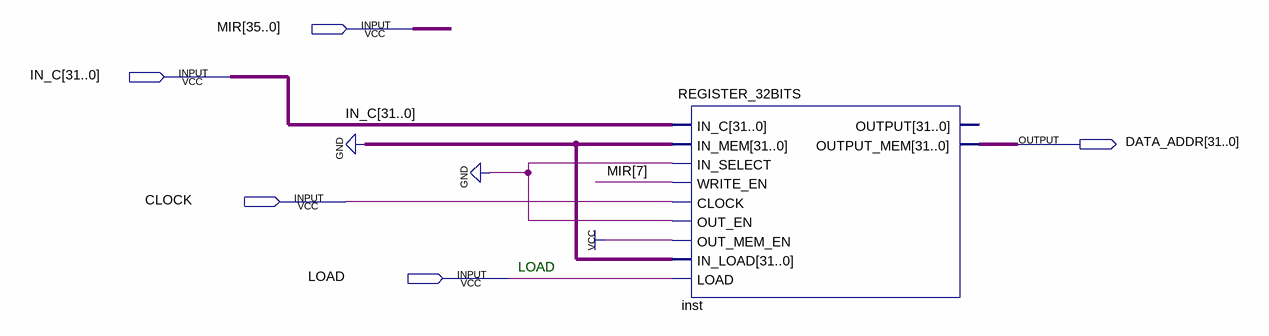
[diagram p0: schematic sheet]
// Quartus schematic MAR.bdf as structural Verilog: 1 symbols, 5 pins
module MAR (
  input  [35:0] MIR,
  input  [31:0] IN_C,
  input  CLOCK,
  input  LOAD,
  output [31:0] DATA_ADDR
);

  REGISTER_32BITS inst (
    .IN_C(IN_C), .IN_MEM({32{1'b0}}), .IN_SELECT(1'b0), .WRITE_EN(MIR[7]), .CLOCK(CLOCK), .OUT_EN(1'b0),
    .OUT_MEM_EN(1'b1), .IN_LOAD({32{1'b0}}), .LOAD(LOAD), .OUTPUT_MEM(DATA_ADDR));  // open: OUTPUT

  // Notes on the sheet:
  //   LOAD
endmodule
